# Altium project IMX8SoCIot.PrjPcb (part 7 of 9)

## Sheet USB_PER2.SchDoc
size 594 x 420 mm; SheetNumber: 16; SheetTotal: 20
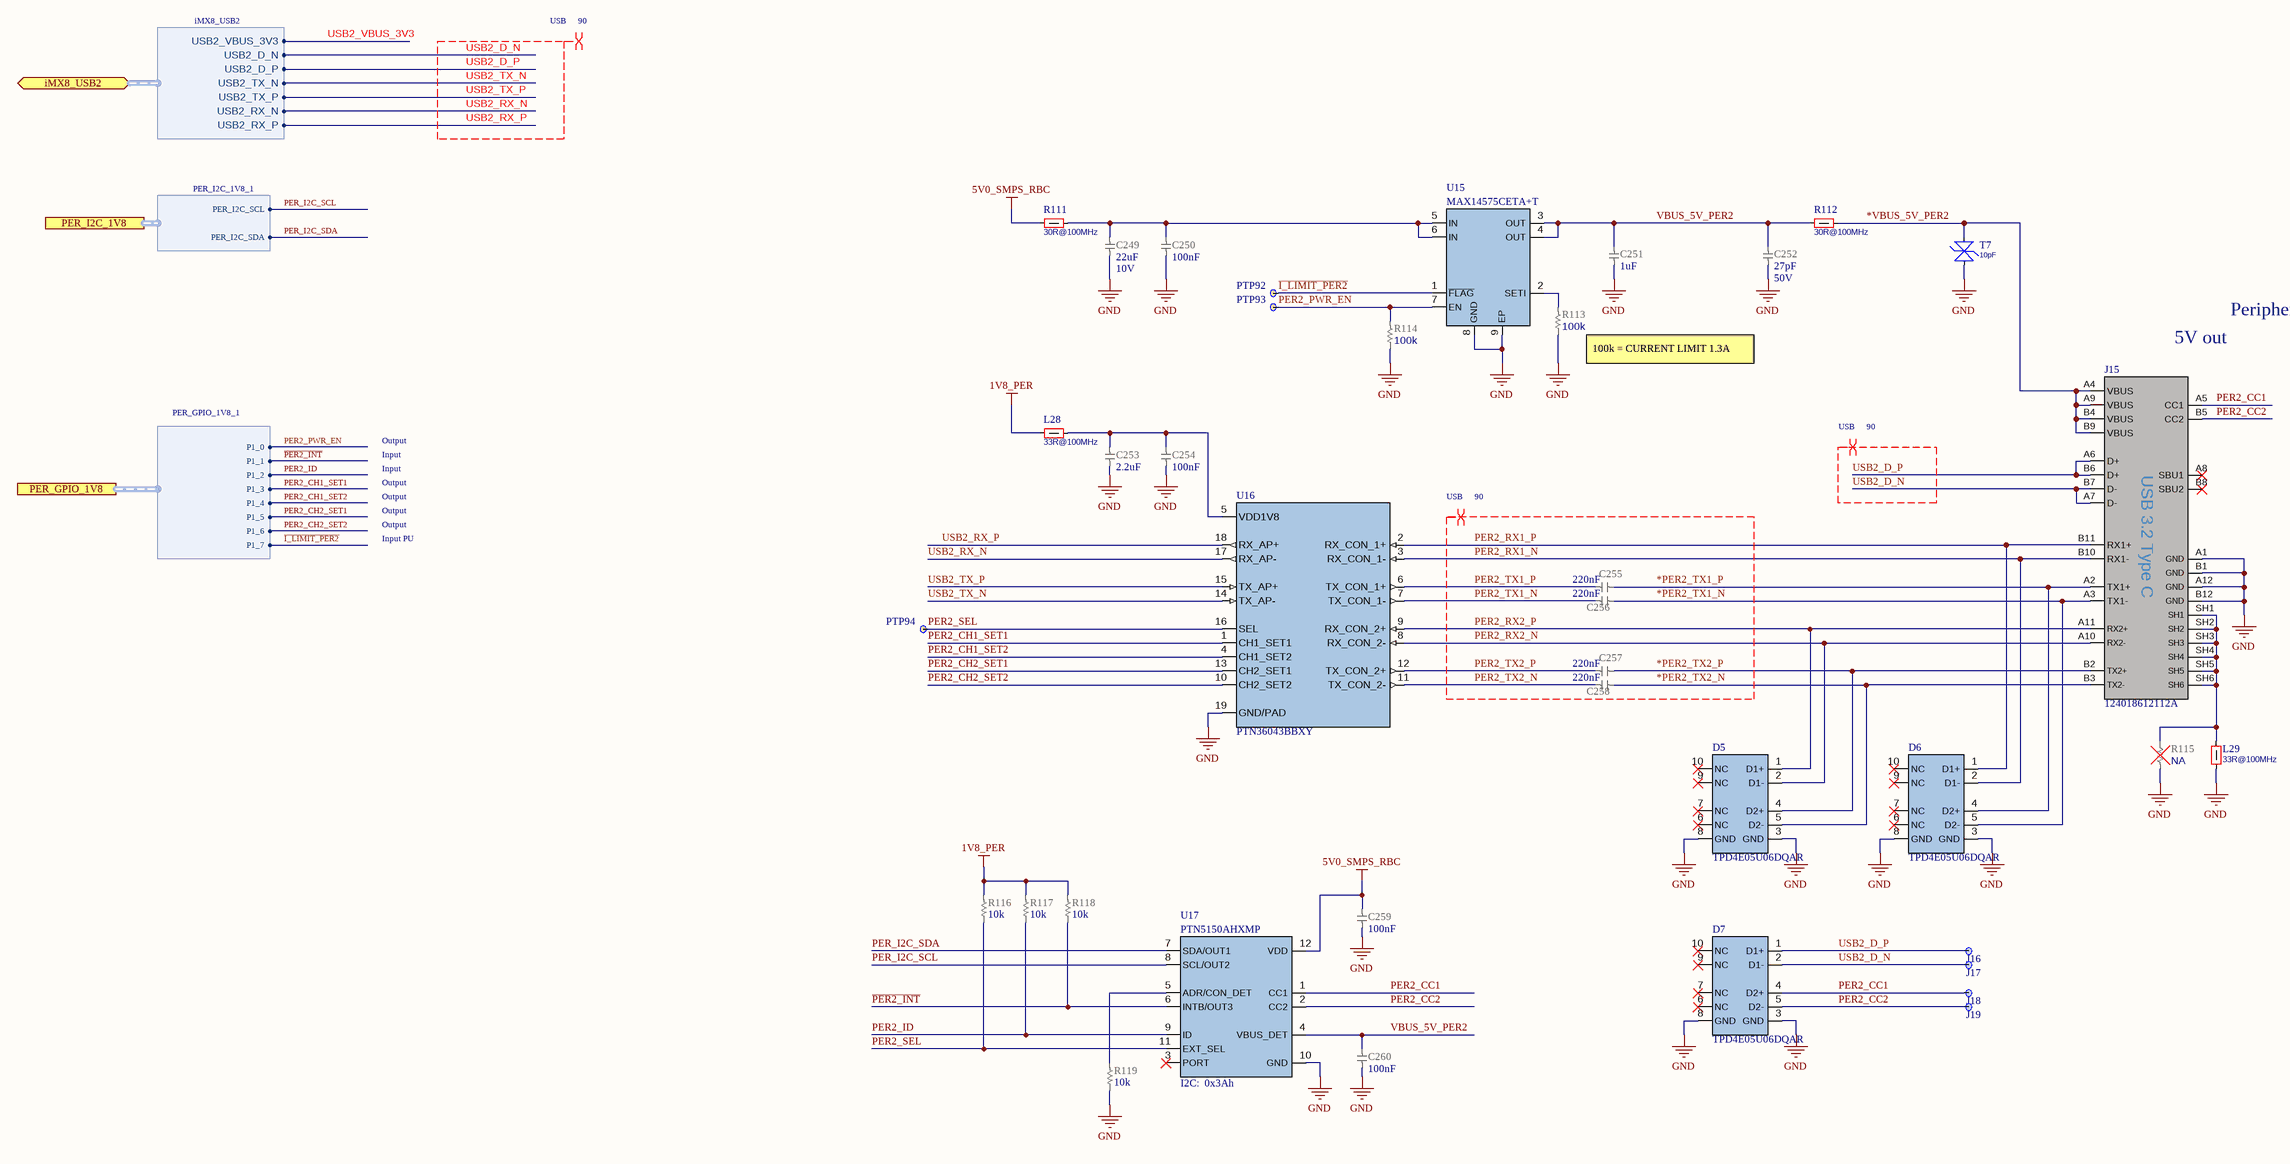
[diagram p27: USB_PER2.SchDoc]

### Parts
C249  value 22uF  Voltage: 10V  [CAP_0805_UN1Q]  (hidden comment: CAP_0805_22uF_10V_X7R)
C250  value 100nF  [CAP_0201_UN1Q]  (hidden comment: CAP_0201_100n_X7S_16V)
C251  value 1uF  [CAP_0201_UN1Q]  (hidden comment: CAP_0201_1uF_X6S)
C252  value 27pF  Voltage: 50V  [CAP_0201_UN1Q]  (hidden comment: CAP_0201_27p)
C253  value 2.2uF  [CAP_0402_H09W07_UN1Q]  (hidden comment: CAP_0402_2u2_10V_X6S)
C254  value 100nF  [CAP_0201_UN1Q]  (hidden comment: CAP_0201_100n_X7S_16V)
C255  value 220nF  [CAP_0201_UN1Q]  (hidden comment: CAP_0201_220n_10V_X6S)
C256  value 220nF  [CAP_0201_UN1Q]  (hidden comment: CAP_0201_220n_10V_X6S)
C257  value 220nF  [CAP_0201_UN1Q]  (hidden comment: CAP_0201_220n_10V_X6S)
C258  value 220nF  [CAP_0201_UN1Q]  (hidden comment: CAP_0201_220n_10V_X6S)
C259  value 100nF  [CAP_0201_UN1Q]  (hidden comment: CAP_0201_100n_X7S_16V)
C260  value 100nF  [CAP_0201_UN1Q]  (hidden comment: CAP_0201_100n_X7S_16V)
D5  TPD4E05U06DQAR  [USON10_DQA_TI]
D6  TPD4E05U06DQAR  [USON10_DQA_TI]
D7  TPD4E05U06DQAR  [USON10_DQA_TI]
J15  Part Number: 124018612112A  [USB_C_AMPHENOL_124018612112A]  (hidden comment: USB_C_AMPHENOL_124018612112A)
J16  Testpoint, Surface, 1.0mm  [TP_1mm_UN1Q]  (value not drawn)  (no BOM)
J17  Testpoint, Surface, 1.0mm  [TP_1mm_UN1Q]  (value not drawn)  (no BOM)
J18  Testpoint, Surface, 1.0mm  [TP_1mm_UN1Q]  (value not drawn)  (no BOM)
J19  Testpoint, Surface, 1.0mm  [TP_1mm_UN1Q]  (value not drawn)  (no BOM)
L28  value 33R@100MHz  [IND_0201_UN1Q]  (hidden comment: FERRITE_0201_BLM03_33Ohm)
L29  value 33R@100MHz  [IND_0201_UN1Q]  (hidden comment: FERRITE_0201_BLM03_33Ohm)
PTP92  PTP_0.4mm  [PTP_0.4mm]  (value not drawn)  (no BOM)
PTP93  PTP_0.4mm  [PTP_0.4mm]  (value not drawn)  (no BOM)
PTP94  PTP_0.4mm  [PTP_0.4mm]  (value not drawn)  (no BOM)
R111  value 30R@100MHz  [FERR_BLM15KD]  (hidden comment: FERRITE_0402_BLM15KD)
R112  value 30R@100MHz  [FERR_BLM15KD]  (hidden comment: FERRITE_0402_BLM15KD)
R113  value 100k  [RES_0201_UN1Q]  (hidden comment: RES_0201_100k)
R114  value 100k  [RES_0201_UN1Q]  (hidden comment: RES_0201_100k)
R115  value NA  [RES_0201_UN1Q]  (hidden comment: RES_0201_NA)
R116  value 10k  [RES_0201_UN1Q]  (hidden comment: RES_0201_10k)
R117  value 10k  [RES_0201_UN1Q]  (hidden comment: RES_0201_10k)
R118  value 10k  [RES_0201_UN1Q]  (hidden comment: RES_0201_10k)
R119  value 10k  [RES_0201_UN1Q]  (hidden comment: RES_0201_10k)
T7  value 10pF  [TVS_0201_EZAEG]  (hidden comment: TVS_0201_10pF)
U15  Part Number: MAX14575CETA+T  [TDFN8-MAX14575C]  (hidden comment: MAX14575C)
U16  PTN36043BBXY  [DHX2QFN18_NXP]
U17  PTN5150AHXMP  [X2QFN12_NXP]

### Ports
iMX8_USB2 (bidir, harness iMX8_USB2), PER_GPIO_1V8 (harness PER_GPIO_1V8_1), PER_I2C_1V8 (harness PER_I2C_1V8_1)

### Harnesses
PER_GPIO_1V8_1: P1_0, P1_1, P1_2, P1_3, P1_4, P1_5, P1_6, P1_7
PER_I2C_1V8_1: PER_I2C_SCL, PER_I2C_SDA
iMX8_USB2: USB2_VBUS_3V3, USB2_D_N, USB2_D_P, USB2_TX_N, USB2_TX_P, USB2_RX_N, USB2_RX_P

### Nets
1V8_PER: L28.1 R116.2 R117.2 R118.2
5V0_SMPS_RBC: C259.1 R111.1 U17.12(VDD)
GND: C249.1 C250.1 C251.1 C252.1 C253.2 C254.2 C259.2 C260.2 D5.3(GND) D5.8(GND) D6.3(GND) D6.8(GND) D7.3(GND) D7.8(GND) J15.A1(GND) J15.A12(GND) J15.B1(GND) J15.B12(GND) L29.2 R113.1 R114.1 R115.2 R119.1 T7.1 U15.8(GND) U15.9(EP) U16.19(GND/PAD) U17.10(GND)
*PER2_TX1_N: C256.1 D6.5(D2-) J15.A3(TX1-)
*PER2_TX1_P: C255.1 D6.4(D2+) J15.A2(TX1+)
*PER2_TX2_N: C258.1 D5.5(D2-) J15.B3(TX2-)
*PER2_TX2_P: C257.1 D5.4(D2+) J15.B2(TX2+)
*VBUS_5V_PER2: J15.A4(VBUS) J15.A9(VBUS) J15.B4(VBUS) J15.B9(VBUS) R112.2 T7.2
~{I_LIMIT_PER2}: PTP92.1(TP) U15.1(~{FLAG}) ; port PER_GPIO_1V8.P1_7
~{PER2_INT}: R118.1 U17.6(INTB/OUT3) ; port PER_GPIO_1V8.P1_1
PER2_CC1: D7.4(D2+) J15.A5(CC1) J18.1(TP) U17.1(CC1)
PER2_CC2: D7.5(D2-) J15.B5(CC2) J19.1(TP) U17.2(CC2)
PER2_CH1_SET1: U16.1(CH1_SET1) ; port PER_GPIO_1V8.P1_3
PER2_CH1_SET2: U16.4(CH1_SET2) ; port PER_GPIO_1V8.P1_4
PER2_CH2_SET1: U16.13(CH2_SET1) ; port PER_GPIO_1V8.P1_5
PER2_CH2_SET2: U16.10(CH2_SET2) ; port PER_GPIO_1V8.P1_6
PER2_ID: R117.1 U17.9(ID) ; port PER_GPIO_1V8.P1_2
PER2_PWR_EN: PTP93.1(TP) R114.2 U15.7(EN) ; port PER_GPIO_1V8.P1_0
PER2_RX1_N: D6.2(D1-) J15.B10(RX1-) U16.3(RX_CON_1-)
PER2_RX1_P: D6.1(D1+) J15.B11(RX1+) U16.2(RX_CON_1+)
PER2_RX2_N: D5.2(D1-) J15.A10(RX2-) U16.8(RX_CON_2-)
PER2_RX2_P: D5.1(D1+) J15.A11(RX2+) U16.9(RX_CON_2+)
PER2_SEL: PTP94.1(TP) R116.1 U16.16(SEL) U17.11(EXT_SEL)
PER2_TX1_N: C256.2 U16.7(TX_CON_1-)
PER2_TX1_P: C255.2 U16.6(TX_CON_1+)
PER2_TX2_N: C258.2 U16.11(TX_CON_2-)
PER2_TX2_P: C257.2 U16.12(TX_CON_2+)
PER_I2C_SCL: U17.8(SCL/OUT2) ; port PER_I2C_1V8.PER_I2C_SCL
PER_I2C_SDA: U17.7(SDA/OUT1) ; port PER_I2C_1V8.PER_I2C_SDA
USB2_D_N: D7.2(D1-) J15.A7(D-) J15.B7(D-) J17.1(TP) ; port iMX8_USB2.USB2_D_N
USB2_D_P: D7.1(D1+) J15.A6(D+) J15.B6(D+) J16.1(TP) ; port iMX8_USB2.USB2_D_P
USB2_RX_N: U16.17(RX_AP-) ; port iMX8_USB2.USB2_RX_N
USB2_RX_P: U16.18(RX_AP+) ; port iMX8_USB2.USB2_RX_P
USB2_TX_N: U16.14(TX_AP-) ; port iMX8_USB2.USB2_TX_N
USB2_TX_P: U16.15(TX_AP+) ; port iMX8_USB2.USB2_TX_P
VBUS_5V_PER2: C251.2 C252.2 C260.1 R112.1 U15.3(OUT) U15.4(OUT) U17.4(VBUS_DET)
NetC249_2: C249.2 C250.2 R111.2 U15.5(IN) U15.6(IN)
NetC253_1: C253.1 C254.1 L28.2 U16.5(VDD1V8)
NetJ15_SH1: J15.SH1 J15.SH2 J15.SH3 J15.SH4 J15.SH5 J15.SH6 L29.1 R115.1
NetR113_2: R113.2 U15.2(SETI)
NetR119_2: R119.2 U17.5(ADR/CON_DET)

Not connected (* = marked no-connect by the designer): D5 6(NC)* 7(NC)* 9(NC)* 10(NC)*; D6 6(NC)* 7(NC)* 9(NC)* 10(NC)*; D7 6(NC)* 7(NC)* 9(NC)* 10(NC)*; J15 A8(SBU1)* B8(SBU2)*; U17 3(PORT)*

### Layout directives
differential pair; differential pair class 90; net class USB; rule Matched Net Lengths [Tolerance = 0.3mm]: *PER2_TX1_N, *PER2_TX1_P, *PER2_TX2_N, *PER2_TX2_P, PER2_RX1_N, PER2_RX1_P, PER2_RX2_N, PER2_RX2_P, PER2_TX1_N, PER2_TX1_P, PER2_TX2_N, PER2_TX2_P, USB2_D_N, USB2_D_P, USB2_RX_N, USB2_RX_P, USB2_TX_N, USB2_TX_P

### Notes on the sheet
- Peripheral Connector 2
- (near R113) 100k = CURRENT LIMIT 1.3A
- (near J15) 5V out
- Output
- Input
- Input PU
- (near U17) I2C:  0x3Ah
- DWG NO:
- REV:
- THIS DOCUMENT AND THE DATA DISCLOSED HEREIN OR
- HEREWITH IS THE PROPERTY OF ALTIUM LIMITED AND MAY
- BE FREELY DISTRIBUTED IN WHOLE. NO RIGHTS ARE
- RESERVED OR EXPRESS OR IMPLIED WARANTEE GIVEN.
- REVISION
- DESCRIPTION
- DATE
- APPROVED
- ENG:
- APPROVALS
- PROJECT
- DSN:
- CHK:
- REFERENCE DOCUMENTS
- PROJECT REVISION:
- TITLE
- DOCUMENT REVISION:
- DESIGN ITEM:
- BOM:
- FAB DWG:
- PCB DWG:
- ASSY DWG:
- SCALE:
- A2
- SIZE
- CAGE CODE
- FILE NAME
- DWG NO.
- SHEET
- OF
- REV
- (in symbol CMP-001-001438-8) USB 3.2 Type C

### Library data of the parts
C249 = CMP-001-000892-11: CAP; Part Number: GRM21BZ71A226ME15L; Manufacturer: Murata; Tolerance: +/-20%; Alternative component: Allowed; Sort order: 308; Temperature characteristics: X7R; System: RLC; HasBeenBuilt: TBD; Creation date: 22032024; ComponentLink4Description: 4_X-information; ComponentLink1Description: 1_Datasheet; ComponentLink3Description: 3_X-information; ComponentLink2Description: 2_Product page; Package: 0805; Manufacturer Part Number: GRM21BZ71A226ME15L; Component Type: Capacitor
C250 C254 C259 C260 = CMP-001-000385-16: CAP; Part Number: GRM033C71C104KE14D; Manufacturer: Murata; Temperature characteristics: X7S; Tolerance: +/-10%; Sort order: 302; HasBeenBuilt: TBD; Alternative component: Allowed; Voltage: 16V; System: RLC; Package: 0201; ClassName: SMALL; ComponentLink1Description: 1_Datasheet; ComponentLink2Description: 2_Product page; ComponentLink3Description: 3_X-information; ComponentLink4Description: 4_X-information; Creation date: 20190101; Source: RLC_UN1Q.SchLib; Manufacturer Part Number: GRM033C71C104KE14D; Component Type: Capacitor
C251 = CMP-001-000336-15: CAP; Part Number: KGM03CS61A105MH; Manufacturer: Kyocera; Manufacturer: KYOCERA AVX; Temperature characteristics: X6S; Voltage: 10V; Tolerance: +/-20%; Sort order: 302; HasBeenBuilt: False; Alternative component: Allowed; System: RLC; Package: 0201; Operating temperature range: -55C to +105C; ClassName: SMALL; ComponentLink1Description: 1_Datasheet; ComponentLink2Description: 2_Product page; ComponentLink3Description: 3_X-information; ComponentLink4Description: 4_X-information; Creation date: 20190101; Source: RLC_UN1Q.SchLib; Manufacturer Part Number: KGM03CS61A105MH; Component Type: Capacitor
C252 = CMP-001-000280-15: CAP; Part Number: GRM0335C1H270JA01D; Manufacturer: TDK; Manufacturer: Murata; Temperature characteristics: C0G; Tolerance: +/-5%; Sort order: 302; HasBeenBuilt: TBD; Alternative component: Allowed; System: RLC; Package: 0201; ComponentLink1Description: 1_Datasheet; ComponentLink2Description: 2_Product page; ComponentLink3Description: 3_X-information; ComponentLink4Description: 4_X-information; Creation date: 20190101; ClassName: SMALL; Source: RLC_UN1Q.SchLib; Manufacturer Part Number: GRM0335C1H270JA01D; Component Type: Capacitor
C253 = CMP-001-000887-10: CAP; Part Number: GRM155C81A225KE44D; Manufacturer: Murata; Temperature characteristics: X6S; Voltage: 10V; Tolerance: +/-10%; Sort order: 304; Alternative component: Allowed; System: RLC; Package: 0402; ComponentLink1Description: 1_Datasheet; ComponentLink2Description: 2_Product page; ComponentLink3Description: 3_X-information; ComponentLink4Description: 4_X-information; Creation date: 20190101; Manufacturer Part Number: GRM155C81A225KE44D; Component Type: Capacitor
C255-C258 = CMP-001-000889-11: CAP; Part Number: GRM033C81A224KE01D; Manufacturer: Murata; Temperature characteristics: X6S; Voltage: 10V; Tolerance: +/-20%; Sort order: 302; HasBeenBuilt: TBD; Alternative component: Allowed; System: RLC; Package: 0201; Dimensions WxLxH: 0.35; ComponentLink1Description: 1_Datasheet; ComponentLink2Description: 2_Product page; ComponentLink3Description: 3_X-information; ComponentLink4Description: 4_X-information; Creation date: 26042024; ClassName: SMALL; Manufacturer Part Number: GRM033C81A224KE01D; Component Type: Capacitor
D5-D7 = CMP-001-000916-4: 4-CH Low-Capacitance ESD Diode; Manufacturer: Texas Instruments; HasBeenBuilt: Saluki3_HW_RIB_2; Sort order: 405; System: IC; ComponentLink1Description: 1_Datasheet; ComponentLink1URL: http://www.ti.com/lit/gpn/tpd4e05u06; ComponentLink2Description: 2_Product page; ComponentLink2URL: https://www.ti.com/product/TPD4E05U06; ComponentLink3Description: 3_X-information; ComponentLink4Description: 4_X-information; Creation date: 20210927; Dimensions WxLxH: 2.5x1.0x0.55; Operating temperature range: -40... +125 °C; Package: USON10; Part Number: TPD4E05U06DQAR; ECCN: EAR99; RoHS: RoHS3; Source: UUDET_KOMPONENTIT.SchLib; Manufacturer Part Number: TPD4E05U06DQAR; Component Type: ESD & EMI
J15 = CMP-001-001438-8: USB3.2 GEN1, Type C, Top mount, CH 1.50mm, Dual Row SMT, IPX8; Manufacturer Part Number: 12402082E512A; Sort order: 101; System: Connector; ClassName: BIG; ComponentLink1Description: 1_Datasheet; ComponentLink1URL: https://cdn.amphenol-cs.com/media/wysiwyg/files/documentation/datasheet/inputoutput/io_usb_type_c.pdf; ComponentLink2Description: 2_Product page; ComponentLink2URL: https://www.amphenol-cs.com/product/124018612112a.html; ComponentLink3Description: 3_X-information; ComponentLink4Description: 4_X-information; Operating temperature range: -40C to +85C; Creation date: 20250617; Manufacturer: Amphenol; ECCN: EAR99; Design Item ID: USB_C_AMPHENOL_124018612112A; RoHS: RoHS 3; Component Type: Interface Connector
J16-J19 = CMP-001-000153-12: Testpoint 1.0mm; Part Number: TP 1mm; Sort order: -; HasBeenBuilt: -; ClassName: SMALL; ComponentLink1Description: 1_Datasheet; ComponentLink2Description: 2_Product page; ComponentLink3Description: 3_X-information; ComponentLink4Description: 4_X-information; Creation date: 20200101; System: Test Point; Design Item ID: TP_1mm; Source: Conn_UN1Q.SchLib; Component Type: Test Point
L28 L29 = CMP-001-000744-7: FERRITE; Manufacturer: Murata; Part Number: BLM03PG330SN1; Tolerance: 25%; Sort order: 362; HasBeenBuilt: TBD; System: Discrete; Package: 0201; Operating temperature range: -55 ... +125C; ClassName: SMALL; ComponentLink1Description: 1_Datasheet; ComponentLink1URL: https://www.murata.com/en-us/products/productdetail.aspx?cate=luNoiseSupprFilteChipFerriBead&partno=BLM03PG330SN1%23; ComponentLink2Description: 2_Product page; ComponentLink3Description: 3_X-information; ComponentLink4Description: 4_X-information; Creation date: 20200304; Source: Discrete_UN1Q.SchLib; Manufacturer Part Number: BLM03PG330SN1; Component Type: Ferrite
PTP92-PTP94 = CMP-001-001296-3: Production Testpoint 0.4mm. Flying probe. Use 1mm pitch.; Part Number: PTP 0.4mm; ComponentLink4Description: 4_X-information; ComponentLink1Description: 1_Datasheet; Sort order: -; ClassName: SMALL; System: Test Point; HasBeenBuilt: -; Design Item ID: PTP_0.4mm; ComponentLink3Description: 3_X-information; Creation date: 20240909; ComponentLink2Description: 2_Product page; Component Type: Test Point
R111 R112 = CMP-001-000738-12: FERRITE; Part Number: BLM15KD300SN1; Manufacturer: Murata; Manufacturer Part Number: BLM15KD300SN1D; Sort order: 364; HasBeenBuilt: Saluki2; System: Discrete; Current: 3.1A; Package: 0402; Operating temperature range: -55 ... +125C; Dimensions WxLxH: 0.55mm; ComponentLink1Description: 1_Datasheet; ComponentLink1URL: https://www.murata.com/en-us/products/productdetail.aspx?cate=luNoiseSupprFilteChipFerriBead&partno=BLM15KD300SN1%23; ComponentLink2Description: 2_Product page; ComponentLink3Description: 3_X-information; ComponentLink4Description: 4_X-information; Creation date: 20200304; Source: Discrete_UN1Q.SchLib; ECCN: EAR99; RoHS: RoHS3; Component Type: Ferrite
R113 R114 = CMP-001-000526-11: RES; Part Number: RC0201FR-07100KL; Manufacturer: YAGEO; Tolerance: 1%; Power Rating: 1/20W; Sort order: 322; HasBeenBuilt: TBD; Alternative component: Allowed; System: RLC; Package: 0201; ClassName: SMALL; ComponentLink1Description: 1_Datasheet; ComponentLink2Description: 2_Product page; ComponentLink3Description: 3_X-information; ComponentLink4Description: 4_X-information; Creation date: 20190101; Source: RLC_UN1Q.SchLib; Component Type: Resistor
R115 = CMP-001-000434-10: Not Assembled - RES; Sort order: 999; HasBeenBuilt: TBD; System: RLC; Package: 0201; ClassName: SMALL; ComponentLink1Description: 1_Datasheet; ComponentLink2Description: 2_Product page; ComponentLink3Description: 3_X-information; ComponentLink4Description: 4_X-information; Creation date: 20190101; Source: RLC_UN1Q.SchLib; Component Type: Resistor
R116-R119 = CMP-001-000446-13: RES; Part Number: RC0201FR-0710KL; Manufacturer: YAGEO; Power Rating: 1/20W; Sort order: 322; HasBeenBuilt: TBD; Tolerance: 1%; Alternative component: Allowed; System: RLC; Package: 0201; ClassName: SMALL; ComponentLink1Description: 1_Datasheet; ComponentLink2Description: 2_Product page; ComponentLink3Description: 3_X-information; ComponentLink4Description: 4_X-information; Creation date: 20190101; Source: RLC_UN1Q.SchLib; Component Type: Resistor
T7 = CMP-001-000756-6: ESD Protection  TVS Diodes SMP Diode 0201 5vdc 10 pf <8v clamp@1a; Part Number: GG020105100N2P; Manufacturer: TDK; Voltage: 5.5V; Sort order: 402; HasBeenBuilt: TBD; System: Discrete; Package: 0201; Operating temperature range: -40 ... +85C; Dimensions WxLxH: tbd; ComponentLink1Description: 1_Datasheet; ComponentLink1URL: https://www2.mouser.com/datasheet/2/40/AVX_GiGuard-1101674.pdf; ComponentLink2Description: 2_Product page; ComponentLink3Description: 3_X-information; ComponentLink4Description: 4_X-information; Creation date: 20211207; ClassName: SMALL; Source: Discrete_UN1Q.SchLib; Manufacturer Part Number: GG020105100N2P; Component Type: ESD & EMI
U15 = CMP-001-000798-6: ADJ. CURRENT-LIMITED POWER SWITCH, 2.5A; Manufacturer: Maxim Integrated; System: IC; HasBeenBuilt: SleeveIO_01; Sort order: 457; ClassName: BIG; Dimensions WxLxH: 2.05 mm x 2.05 mm x 0.8 mm; ComponentLink4Description: 4_X-information; Design Item ID: MAX14575C; Operating temperature range: -40 ... +85 °C; ComponentLink3Description: 3_X-information; Package: TDFN8; ComponentLink1URL: https://www.analog.com/media/en/technical-documentation/data-sheets/MAX14575A-MAX14575C.pdf; ComponentLink1Description: 1_Datasheet; ComponentLink2Description: 2_Product page; ComponentLink2URL: https://www.analog.com/en/products/max14575c.html; Creation date: 20211018; Source: IC_UN1Q.SchLib
U16 = CMP-001-001164-4: USB3.1 Gen1 Type-C Superspeed Active Signal Switch; Manufacturer: NXP; Manufacturer: Knowles; Manufacturer Part Number: 1825J0100820FCT; Sort order: 501; System: IC; Dimensions WxLxH: 2.4 x 2.0 x 0.35mm; Operating temperature range: -40C ... +85C; Part Number: PTN36043BBXY; ComponentLink3URL: https://www.nxp.com/design/design-center/development-boards-and-designs/analog-toolbox/ptn5150a-ptn36043-usb-type-c-cc-logic-evaluation-kit:OM13584; Package: DHX2QFN18; ComponentLink1URL: https://www.nxp.com/docs/en/data-sheet/PTN36043B.pdf; ComponentLink2Description: 2_Product page; Creation date: 20250417; ComponentLink3Description: 3_EVA kit; ComponentLink1Description: 1_Datasheet; ComponentLink4Description: 4_X-information; Component Type: Logic
U17 = CMP-076-000050-6: CC logic for USB Type-C applications; Manufacturer: NXP; Sort order: 501; System: IC; HasBeenBuilt: SALUKI_V2; Operating temperature range: -40C ... +85C; Design Item ID: PTN5150AHXMP; ComponentLink3Description: 3_X-information; ComponentLink1Description: 1_Datasheet; Package: X2QFN12; Source: IC_UN1Q.SchLib; ComponentLink4Description: 4_X-information; Dimensions WxLxH: 1.6x1.6x0.4mm; ComponentLink1URL: https://www.nxp.com/docs/en/data-sheet/PTN5150A.pdf; ComponentLink2Description: 2_Product page; ComponentLink2URL: https://www.nxp.com/part/PTN5150AHX#/; Creation date: 20220314; Part Number: PTN5150AHXMP

## Sheet IO_EXPANDER.SchDoc
size 594 x 420 mm; SheetNumber: 17; SheetTotal: 20
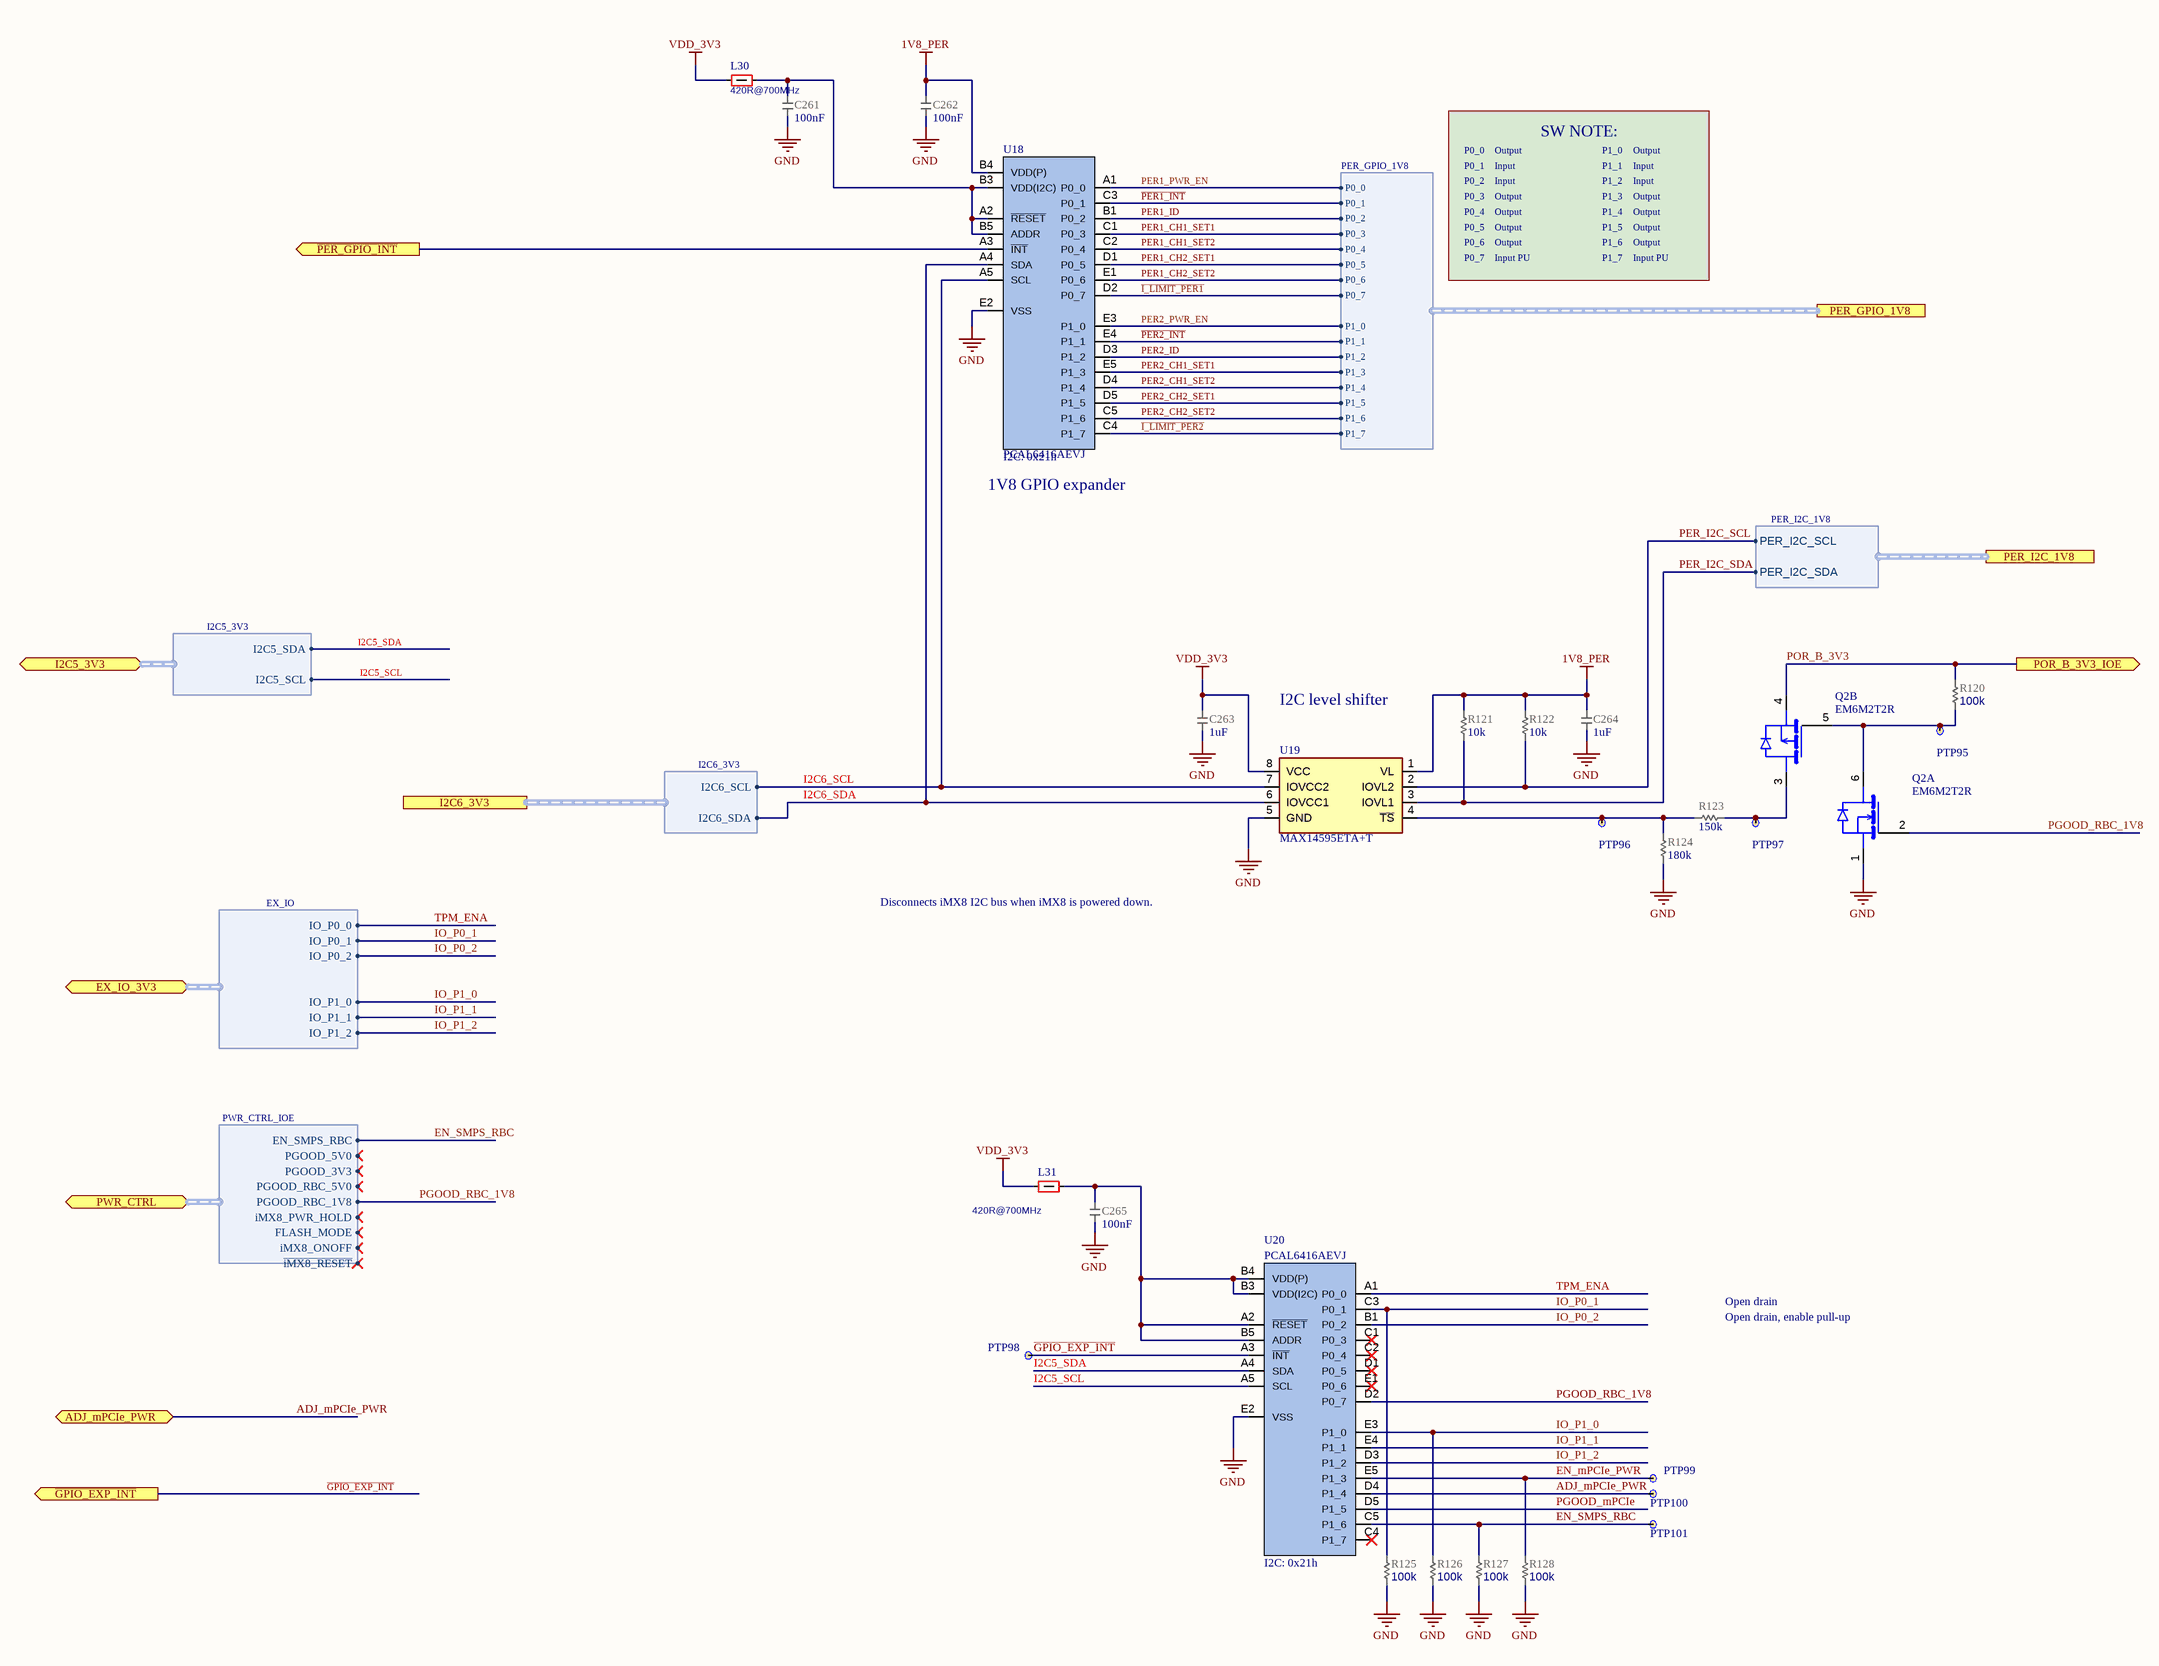
[diagram p28: IO_EXPANDER.SchDoc]

### Parts
C261  value 100nF  [CAP_0201_UN1Q]  (hidden comment: CAP_0201_100n_X7S_16V)
C262  value 100nF  [CAP_0201_UN1Q]  (hidden comment: CAP_0201_100n_X7S_16V)
C263  value 1uF  [CAP_0201_UN1Q]  (hidden comment: CAP_0201_1uF_X6S)
C264  value 1uF  [CAP_0201_UN1Q]  (hidden comment: CAP_0201_1uF_X6S)
C265  value 100nF  [CAP_0201_UN1Q]  (hidden comment: CAP_0201_100n_X7S_16V)
L30  value 420R@700MHz  [IND_0201_UN1Q]  (hidden comment: FERRITE_0201_BLF_700MHz_420Ohm)
L31  value 420R@700MHz  [IND_0201_UN1Q]  (hidden comment: FERRITE_0201_BLF_700MHz_420Ohm)
PTP95  PTP_0.4mm  [PTP_0.4mm]  (value not drawn)  (no BOM)
PTP96  PTP_0.4mm  [PTP_0.4mm]  (value not drawn)  (no BOM)
PTP97  PTP_0.4mm  [PTP_0.4mm]  (value not drawn)  (no BOM)
PTP98  PTP_0.4mm  [PTP_0.4mm]  (value not drawn)  (no BOM)
PTP99  PTP_0.4mm  [PTP_0.4mm]  (value not drawn)  (no BOM)
PTP100  PTP_0.4mm  [PTP_0.4mm]  (value not drawn)  (no BOM)
PTP101  PTP_0.4mm  [PTP_0.4mm]  (value not drawn)  (no BOM)
Q2  EM6M2T2R  [SOT-563]  (parts A,B of 2)
R120  value 100k  [RES_0201_UN1Q]  (hidden comment: RES_0201_100k)
R121  value 10k  [RES_0201_UN1Q]  (hidden comment: RES_0201_10k)
R122  value 10k  [RES_0201_UN1Q]  (hidden comment: RES_0201_10k)
R123  value 150k  [RES_0201_UN1Q]  (hidden comment: RES_0201_150k)
R124  value 180k  [RES_0201_UN1Q]  (hidden comment: RES_0201_180k)
R125  value 100k  [RES_0201_UN1Q]  (hidden comment: RES_0201_100k)
R126  value 100k  [RES_0201_UN1Q]  (hidden comment: RES_0201_100k)
R127  value 100k  [RES_0201_UN1Q]  (hidden comment: RES_0201_100k)
R128  value 100k  [RES_0201_UN1Q]  (hidden comment: RES_0201_100k)
U18  Part Number: PCAL6416AEVJ  [VFBGA24P50_300X300X100_NXP]  (hidden comment: PCAL6416AEVJ_VFBGA24)
U19  MAX14595ETA+T  [MAX14591_SON50P200X200X80-8N]
U20  Part Number: PCAL6416AEVJ  [VFBGA24P50_300X300X100_NXP]  (hidden comment: PCAL6416AEVJ_VFBGA24)

### Ports
ADJ_mPCIe_PWR (bidir), EX_IO_3V3 (bidir, harness EX_IO), I2C5_3V3 (bidir, harness I2C5_3V3), I2C6_3V3 (harness I2C6_3V3), PER_GPIO_1V8 (harness PER_GPIO_1V8), PER_I2C_1V8 (harness PER_I2C_1V8), POR_B_3V3_IOE (out), PWR_CTRL (bidir, harness PWR_CTRL_IOE), ~{GPIO_EXP_INT} (out), ~{PER_GPIO_INT} (out)

### Harnesses
PER_I2C_1V8: PER_I2C_SCL, PER_I2C_SDA
PER_GPIO_1V8: P0_0, P0_1, P0_2, P0_3, P0_4, P0_5, P0_6, P0_7, P1_0, P1_1, P1_2, P1_3, P1_4, P1_5, P1_6, P1_7
I2C6_3V3: I2C6_SDA, I2C6_SCL
PWR_CTRL_IOE: PGOOD_3V3, FLASH_MODE, PGOOD_RBC_1V8, PGOOD_5V0, iMX8_ONOFF, ~{iMX8_RESET}, EN_SMPS_RBC, iMX8_PWR_HOLD, PGOOD_RBC_5V0
EX_IO: IO_P0_2, IO_P1_1, IO_P0_1, IO_P0_0, IO_P1_2, IO_P1_0
I2C5_3V3: I2C5_SDA, I2C5_SCL

### Nets
1V8_PER: C262.2 C264.2 R121.2 R122.2 U18.B4(VDD(P)) U19.1(VL)
GND: C261.1 C262.1 C263.1 C264.1 C265.1 Q2.1(S) R124.1 R125.1 R126.1 R127.1 R128.1 U18.E2(VSS) U19.5(GND) U20.E2(VSS)
VDD_3V3: C263.2 L30.1 L31.1 U19.8(VCC)
~{GPIO_EXP_INT}: PTP98.1(TP) U20.A3(~{INT}) ; port ~{GPIO_EXP_INT}
~{I_LIMIT_PER1}: U18.D2(P0_7) ; port PER_GPIO_1V8.P0_7
~{I_LIMIT_PER2}: U18.C4(P1_7) ; port PER_GPIO_1V8.P1_7
~{PER1_INT}: U18.C3(P0_1) ; port PER_GPIO_1V8.P0_1
~{PER2_INT}: U18.E4(P1_1) ; port PER_GPIO_1V8.P1_1
ADJ_mPCIe_PWR: PTP100.1(TP) U20.D4(P1_4) ; port ADJ_mPCIe_PWR
EN_mPCIe_PWR: PTP99.1(TP) R128.2 U20.E5(P1_3)
EN_SMPS_RBC: PTP101.1(TP) R127.2 U20.C5(P1_6) ; port PWR_CTRL.EN_SMPS_RBC
GPIO1_IO00: U18.A3(~{INT}) ; port ~{PER_GPIO_INT}
I2C5_SCL: U20.A5(SCL) ; port I2C5_3V3.I2C5_SCL
I2C5_SDA: U20.A4(SDA) ; port I2C5_3V3.I2C5_SDA
I2C6_SCL: U18.A5(SCL) U19.7(IOVCC2) ; port I2C6_3V3.I2C6_SCL
I2C6_SDA: U18.A4(SDA) U19.6(IOVCC1) ; port I2C6_3V3.I2C6_SDA
IO_P0_1: R125.2 U20.C3(P0_1) ; port EX_IO_3V3.IO_P0_1
IO_P0_2: U20.B1(P0_2) ; port EX_IO_3V3.IO_P0_2
IO_P1_0: R126.2 U20.E3(P1_0) ; port EX_IO_3V3.IO_P1_0
IO_P1_1: U20.E4(P1_1) ; port EX_IO_3V3.IO_P1_1
IO_P1_2: U20.D3(P1_2) ; port EX_IO_3V3.IO_P1_2
PER1_CH1_SET1: U18.C1(P0_3) ; port PER_GPIO_1V8.P0_3
PER1_CH1_SET2: U18.C2(P0_4) ; port PER_GPIO_1V8.P0_4
PER1_CH2_SET1: U18.D1(P0_5) ; port PER_GPIO_1V8.P0_5
PER1_CH2_SET2: U18.E1(P0_6) ; port PER_GPIO_1V8.P0_6
PER1_ID: U18.B1(P0_2) ; port PER_GPIO_1V8.P0_2
PER1_PWR_EN: U18.A1(P0_0) ; port PER_GPIO_1V8.P0_0
PER2_CH1_SET1: U18.E5(P1_3) ; port PER_GPIO_1V8.P1_3
PER2_CH1_SET2: U18.D4(P1_4) ; port PER_GPIO_1V8.P1_4
PER2_CH2_SET1: U18.D5(P1_5) ; port PER_GPIO_1V8.P1_5
PER2_CH2_SET2: U18.C5(P1_6) ; port PER_GPIO_1V8.P1_6
PER2_ID: U18.D3(P1_2) ; port PER_GPIO_1V8.P1_2
PER2_PWR_EN: U18.E3(P1_0) ; port PER_GPIO_1V8.P1_0
PER_I2C_SCL: R122.1 U19.2(IOVL2) ; port PER_I2C_1V8.PER_I2C_SCL
PER_I2C_SDA: R121.1 U19.3(IOVL1) ; port PER_I2C_1V8.PER_I2C_SDA
PGOOD_mPCIe: U20.D5(P1_5)
PGOOD_RBC_1V8: Q2.2(G) U20.D2(P0_7) ; port PWR_CTRL.PGOOD_RBC_1V8
POR_B_3V3: Q2.4(S) R120.2 ; port POR_B_3V3_IOE
TPM_ENA: U20.A1(P0_0) ; port EX_IO_3V3.IO_P0_0
NetC261_2: C261.2 L30.2 U18.A2(~{RESET}) U18.B3(VDD(I2C)) U18.B5(ADDR)
NetC265_2: C265.2 L31.2 U20.A2(~{RESET}) U20.B3(VDD(I2C)) U20.B4(VDD(P)) U20.B5(ADDR)
NetPTP95_1: PTP95.1(TP) Q2.5(G) Q2.6(D) R120.1
NetPTP96_1: PTP96.1(TP) R123.1 R124.2 U19.4(~{TS})
NetPTP97_1: PTP97.1(TP) Q2.3(D) R123.2

Not connected (* = marked no-connect by the designer): U20 C1(P0_3)* C2(P0_4)* C4(P1_7)* D1(P0_5)* E1(P0_6)*

### Notes on the sheet
- P0_0
- Output
- SW NOTE:
- P1_0
- P0_1
- P0_2
- P0_3
- P0_4
- Input
- P1_1
- P1_2
- P1_3
- P1_4
- P0_5
- P0_6
- P0_7
- Input PU
- P1_5
- P1_6
- P1_7
- (near U18) I2C: 0x21h
- (near U18) 1V8 GPIO expander
- I2C level shifter
- Disconnects iMX8 I2C bus when iMX8 is powered down.
- Open drain
- Open drain, enable pull-up
- (near U20) I2C: 0x21h
- DWG NO:
- REV:
- THIS DOCUMENT AND THE DATA DISCLOSED HEREIN OR
- HEREWITH IS THE PROPERTY OF ALTIUM LIMITED AND MAY
- BE FREELY DISTRIBUTED IN WHOLE. NO RIGHTS ARE
- RESERVED OR EXPRESS OR IMPLIED WARANTEE GIVEN.
- REVISION
- DESCRIPTION
- DATE
- APPROVED
- ENG:
- APPROVALS
- PROJECT
- DSN:
- CHK:
- REFERENCE DOCUMENTS
- PROJECT REVISION:
- TITLE
- DOCUMENT REVISION:
- DESIGN ITEM:
- BOM:
- FAB DWG:
- PCB DWG:
- ASSY DWG:
- SCALE:
- A2
- SIZE
- CAGE CODE
- FILE NAME
- DWG NO.
- SHEET
- OF
- REV

### Library data of the parts
C261 C262 C265 = CMP-001-000385-16: as C250 on sheet USB_PER2; Package: 0201; ClassName: SMALL; ComponentLink1Description: 1_Datasheet; ComponentLink2Description: 2_Product page; ComponentLink3Description: 3_X-information; ComponentLink4Description: 4_X-information; Creation date: 20190101; Source: RLC_UN1Q.SchLib; Manufacturer Part Number: GRM033C71C104KE14D; Component Type: Capacitor
C263 C264 = CMP-001-000336-15: as C251 on sheet USB_PER2; Package: 0201; Operating temperature range: -55C to +105C; ClassName: SMALL; ComponentLink1Description: 1_Datasheet; ComponentLink2Description: 2_Product page; ComponentLink3Description: 3_X-information; ComponentLink4Description: 4_X-information; Creation date: 20190101; Source: RLC_UN1Q.SchLib; Manufacturer Part Number: KGM03CS61A105MH; Component Type: Capacitor
L30 L31 = CMP-001-000747-7: FERRITE; Part Number: BLF03JD421GZE; Manufacturer: Murata; HasBeenBuilt: False; System: Discrete; Sort order: 362; Tolerance: 25%; ComponentLink3Description: 3_X-information; Creation date: 20200304; ClassName: SMALL; ComponentLink1Description: 1_Datasheet; ComponentLink2Description: 2_Product page; Package: 0201; ComponentLink4Description: 4_X-information; Source: Discrete_UN1Q.SchLib; Operating temperature range: -55 ... +125C; Manufacturer Part Number: BLF03JD421GZE; Component Type: Ferrite
PTP95-PTP101 = CMP-001-001296-3: as PTP92-PTP94 on sheet USB_PER2; ComponentLink4Description: 4_X-information; ComponentLink1Description: 1_Datasheet; Sort order: -; ClassName: SMALL; System: Test Point; HasBeenBuilt: -; Design Item ID: PTP_0.4mm; ComponentLink3Description: 3_X-information; Creation date: 20240909; ComponentLink2Description: 2_Product page; Component Type: Test Point
Q2 = CMP-031-000021-4: Dual Nch + Pch MOSFET 20V 200mA; Manufacturer: ROHM; Sort order: 501; HasBeenBuilt: CCB30_1; Remark: MFG package EMT6; System: IC; Part Number: EM6M2T2R; ClassName: BIG; ComponentLink1Description: 1_Datasheet; ComponentLink1URL: https://fscdn.rohm.com/en/products/databook/datasheet/discrete/transistor/mosfet/em6m2t2r-e.pdf; ComponentLink2Description: 2_Product page; ComponentLink3Description: 3_X-information; ComponentLink4Description: 4_X-information; Creation date: 20230614; Dimensions WxLxH: 1.6 x 1.6 x 0.5mm; Operating temperature range: -55 ... +155 °C; Package: SOT-563, SOT-666; Source: UUDET_KOMPONENTIT.SchLib; Manufacturer Part Number: EM6M2T2R; Component Type: Transistor
R120 R125-R128 = CMP-001-000526-11: as R113 on sheet USB_PER2; Package: 0201; ClassName: SMALL; ComponentLink1Description: 1_Datasheet; ComponentLink2Description: 2_Product page; ComponentLink3Description: 3_X-information; ComponentLink4Description: 4_X-information; Creation date: 20190101; Source: RLC_UN1Q.SchLib; Component Type: Resistor
R121 R122 = CMP-001-000446-13: as R116-R119 on sheet USB_PER2; Package: 0201; ClassName: SMALL; ComponentLink1Description: 1_Datasheet; ComponentLink2Description: 2_Product page; ComponentLink3Description: 3_X-information; ComponentLink4Description: 4_X-information; Creation date: 20190101; Source: RLC_UN1Q.SchLib; Component Type: Resistor
R123 = CMP-001-000538-13: RES; Part Number: RC0201FR-07150KL; Manufacturer: YAGEO; Tolerance: 1%; Power Rating: 1/20W; Sort order: 322; HasBeenBuilt: TBD; Alternative component: Allowed; System: RLC; Package: 0201; ComponentLink1Description: 1_Datasheet; ComponentLink2Description: 2_Product page; ComponentLink3Description: 3_X-information; ComponentLink4Description: 4_X-information; Creation date: 20211202; ClassName: SMALL; Component Type: Resistor
R124 = CMP-001-000543-12: RES; Part Number: RC0201FR-07180KL; Manufacturer: YAGEO; Tolerance: 1%; Power Rating: 1/20W; Sort order: 322; HasBeenBuilt: TBD; Alternative component: Allowed; System: RLC; Package: 0201; ComponentLink1Description: 1_Datasheet; ComponentLink2Description: 2_Product page; ComponentLink3Description: 3_X-information; ComponentLink4Description: 4_X-information; Creation date: 20190101; ClassName: SMALL; Component Type: Resistor
U18 = CMP-031-000208-3: I/O Expander 16-Bit I²C, SMBus, 0.5mm pitch; Manufacturer: NXP; Manufacturer: NXP Semiconductors; HasBeenBuilt: Saluki3S_1; Sort order: 501; System: IC; ComponentLink1Description: 1_Datasheet; ComponentLink1URL: https://www.nxp.com/docs/en/data-sheet/PCAL6416A.pdf; ComponentLink2Description: 2_Product page; Creation Date: 21122023; Dimensions WxLxH: 3.0 x 3.0 x  1.0mm; Operating temperature range: -40 .... +85 °C; Package: VFBGA24; ECCN: EAR99; Source: UUDET_KOMPONENTIT.SchLib; Design Item ID: PCAL6416AEVJ_VFBGA24; ComponentLink4Description: 4_X-information; ComponentLink3Description: 3_Product_page; RoHS: RoHS3; Manufacturer Part Number: PCAL6416AEVJ; Component Type: Integrated Circuit
U19 = CMP-031-000171-3: High speed, Open-Drain capable logic level translator. Pin compatible with MAX14591ETA.; Manufacturer: Maxim Integrated; Manufacturer: Maxim; HasBeenBuilt: Cmod2_01; Sort order: 501; System: IC; Part Number: MAX14595ETA+T; ClassName: BIG; ComponentLink1Description: 1_Datasheet; ComponentLink1URL: https://datasheets.maximintegrated.com/en/ds/MAX14595.pdf; ComponentLink2Description: 2_Product page; ComponentLink2URL: https://www.maximintegrated.com/en/products/interface/level-translators/MAX14595.html; ComponentLink3Description: 3_X-information; ComponentLink3URL: https://pdfserv.maximintegrated.com/land_patterns/90-0349.PDF; ComponentLink4Description: 4_X-information; Creation date: 20221104; Dimensions WxLxH: 2x2x0.8 mm; Operating temperature range: -40 ... +85 °C; Package: TDFN8; Source: UUDET_KOMPONENTIT.SchLib; Design Item ID: MAX14595ETA_T; Manufacturer Part Number: MAX14595ETA+T; Component Type: Integrated Circuit
U20 = CMP-031-000208-3: I/O Expander 16-Bit I²C, SMBus, 0.5mm pitch; Manufacturer: NXP; HasBeenBuilt: Saluki3S_1; Sort order: 501; System: IC; ComponentLink1Description: 1_Datasheet; ComponentLink1URL: https://www.nxp.com/docs/en/data-sheet/PCAL6416A.pdf; ComponentLink2Description: 2_Product page; Creation Date: 21122023; Dimensions WxLxH: 3.0 x 3.0 x  1.0mm; Operating temperature range: -40 .... +85 °C; Package: VFBGA24; ECCN: EAR99; Source: UUDET_KOMPONENTIT.SchLib; Design Item ID: PCAL6416AEVJ_VFBGA24; ComponentLink4Description: 4_X-information; ComponentLink3Description: 3_Product_page; RoHS: RoHS3